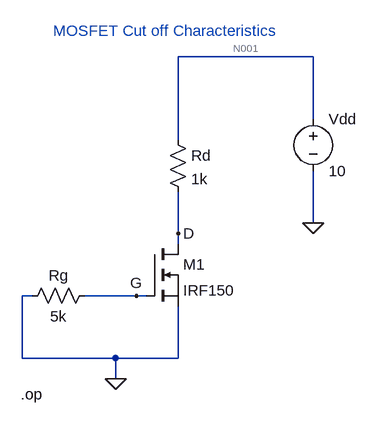
[diagram p0: schematic MOSFET Cut off Characteristics.asc]
MOSFET Cut off Characteristics.asc, the LTspice schematic file:
Version 4
SHEET 1 880 680
WIRE 368 -176 160 -176
WIRE 368 -80 368 -176
WIRE 160 -48 160 -176
WIRE 368 80 368 0
WIRE 160 96 160 32
WIRE 160 112 160 96
WIRE -64 192 -80 192
WIRE 96 192 16 192
WIRE 112 192 96 192
WIRE -80 288 -80 192
WIRE 64 288 -80 288
WIRE 160 288 160 208
WIRE 160 288 64 288
WIRE 64 320 64 288
FLAG 64 320 0
FLAG 368 80 0
FLAG 96 192 G
FLAG 160 96 D
SYMBOL nmos 112 112 R0
SYMATTR InstName M1
SYMATTR Value IRF150
SYMBOL res 32 176 R90
WINDOW 0 0 56 VBottom 2
WINDOW 3 32 56 VTop 2
SYMATTR InstName Rg
SYMATTR Value 5k
SYMBOL res 144 -64 R0
SYMATTR InstName Rd
SYMATTR Value 1k
SYMBOL voltage 368 -96 R0
WINDOW 123 0 0 Left 0
WINDOW 39 0 0 Left 0
SYMATTR InstName Vdd
SYMATTR Value 10
TEXT -82 344 Left 2 !.op
TEXT -32 -216 Left 2 ;MOSFET Cut off Characteristics

The netlist it stands for:
* MOSFET Cut off Characteristics.asc
M1 D G 0 0 IRF150
Rg G 0 5k
Rd N001 D 1k
Vdd N001 0 10
.model NMOS NMOS
.model PMOS PMOS
.lib standard.mos
.op
* MOSFET Cut off Characteristics
.backanno
.end

* Results of the author's LTspice run, read from the files saved beside the schematic
* Operating Point:
*   V(d) = 10 V
*   V(g) = 0 V
*   V(n001) = 10 V
*   Id(M1) = 20.01 pA
*   Ig(M1) = 0 A
*   Ib(M1) = -10.01 pA
*   Is(M1) = -10 pA
*   I(Rd) = 20.01 pA
*   I(Rg) = 0 A
*   I(Vdd) = -20.01 pA
* From the log:
*   Semiconductor Device Operating Points:
*                           --- MOSFET Transistors ---
*   Name:          m1
*   Model:          M
*   Id:          2.00e-11
*   Vgs:         0.00e+00
*   Vds:         1.00e+01
*   Vbs:         0.00e+00
*   Vth:         0.00e+00
*   Vdsat:       0.00e+00
*   Gm:          0.00e+00
*   Gds:         0.00e+00
*   Gmb:         0.00e+00
*   Cbd:         0.00e+00
*   Cbs:         0.00e+00
*   Cgsov:       0.00e+00
*   Cgdov:       0.00e+00
*   Cgbov:       0.00e+00
*   Cgs:         0.00e+00
*   Cgd:         0.00e+00
*   Cgb:        -0.00e+00